# Altium schematic sheet Power_driver_DAC_Connectors.SchDoc
size 420 x 297 mm; Scale: 1:1; DocumentType: Схема электрическая принципиальная; FirstReferrence: АБВГ.123456.001
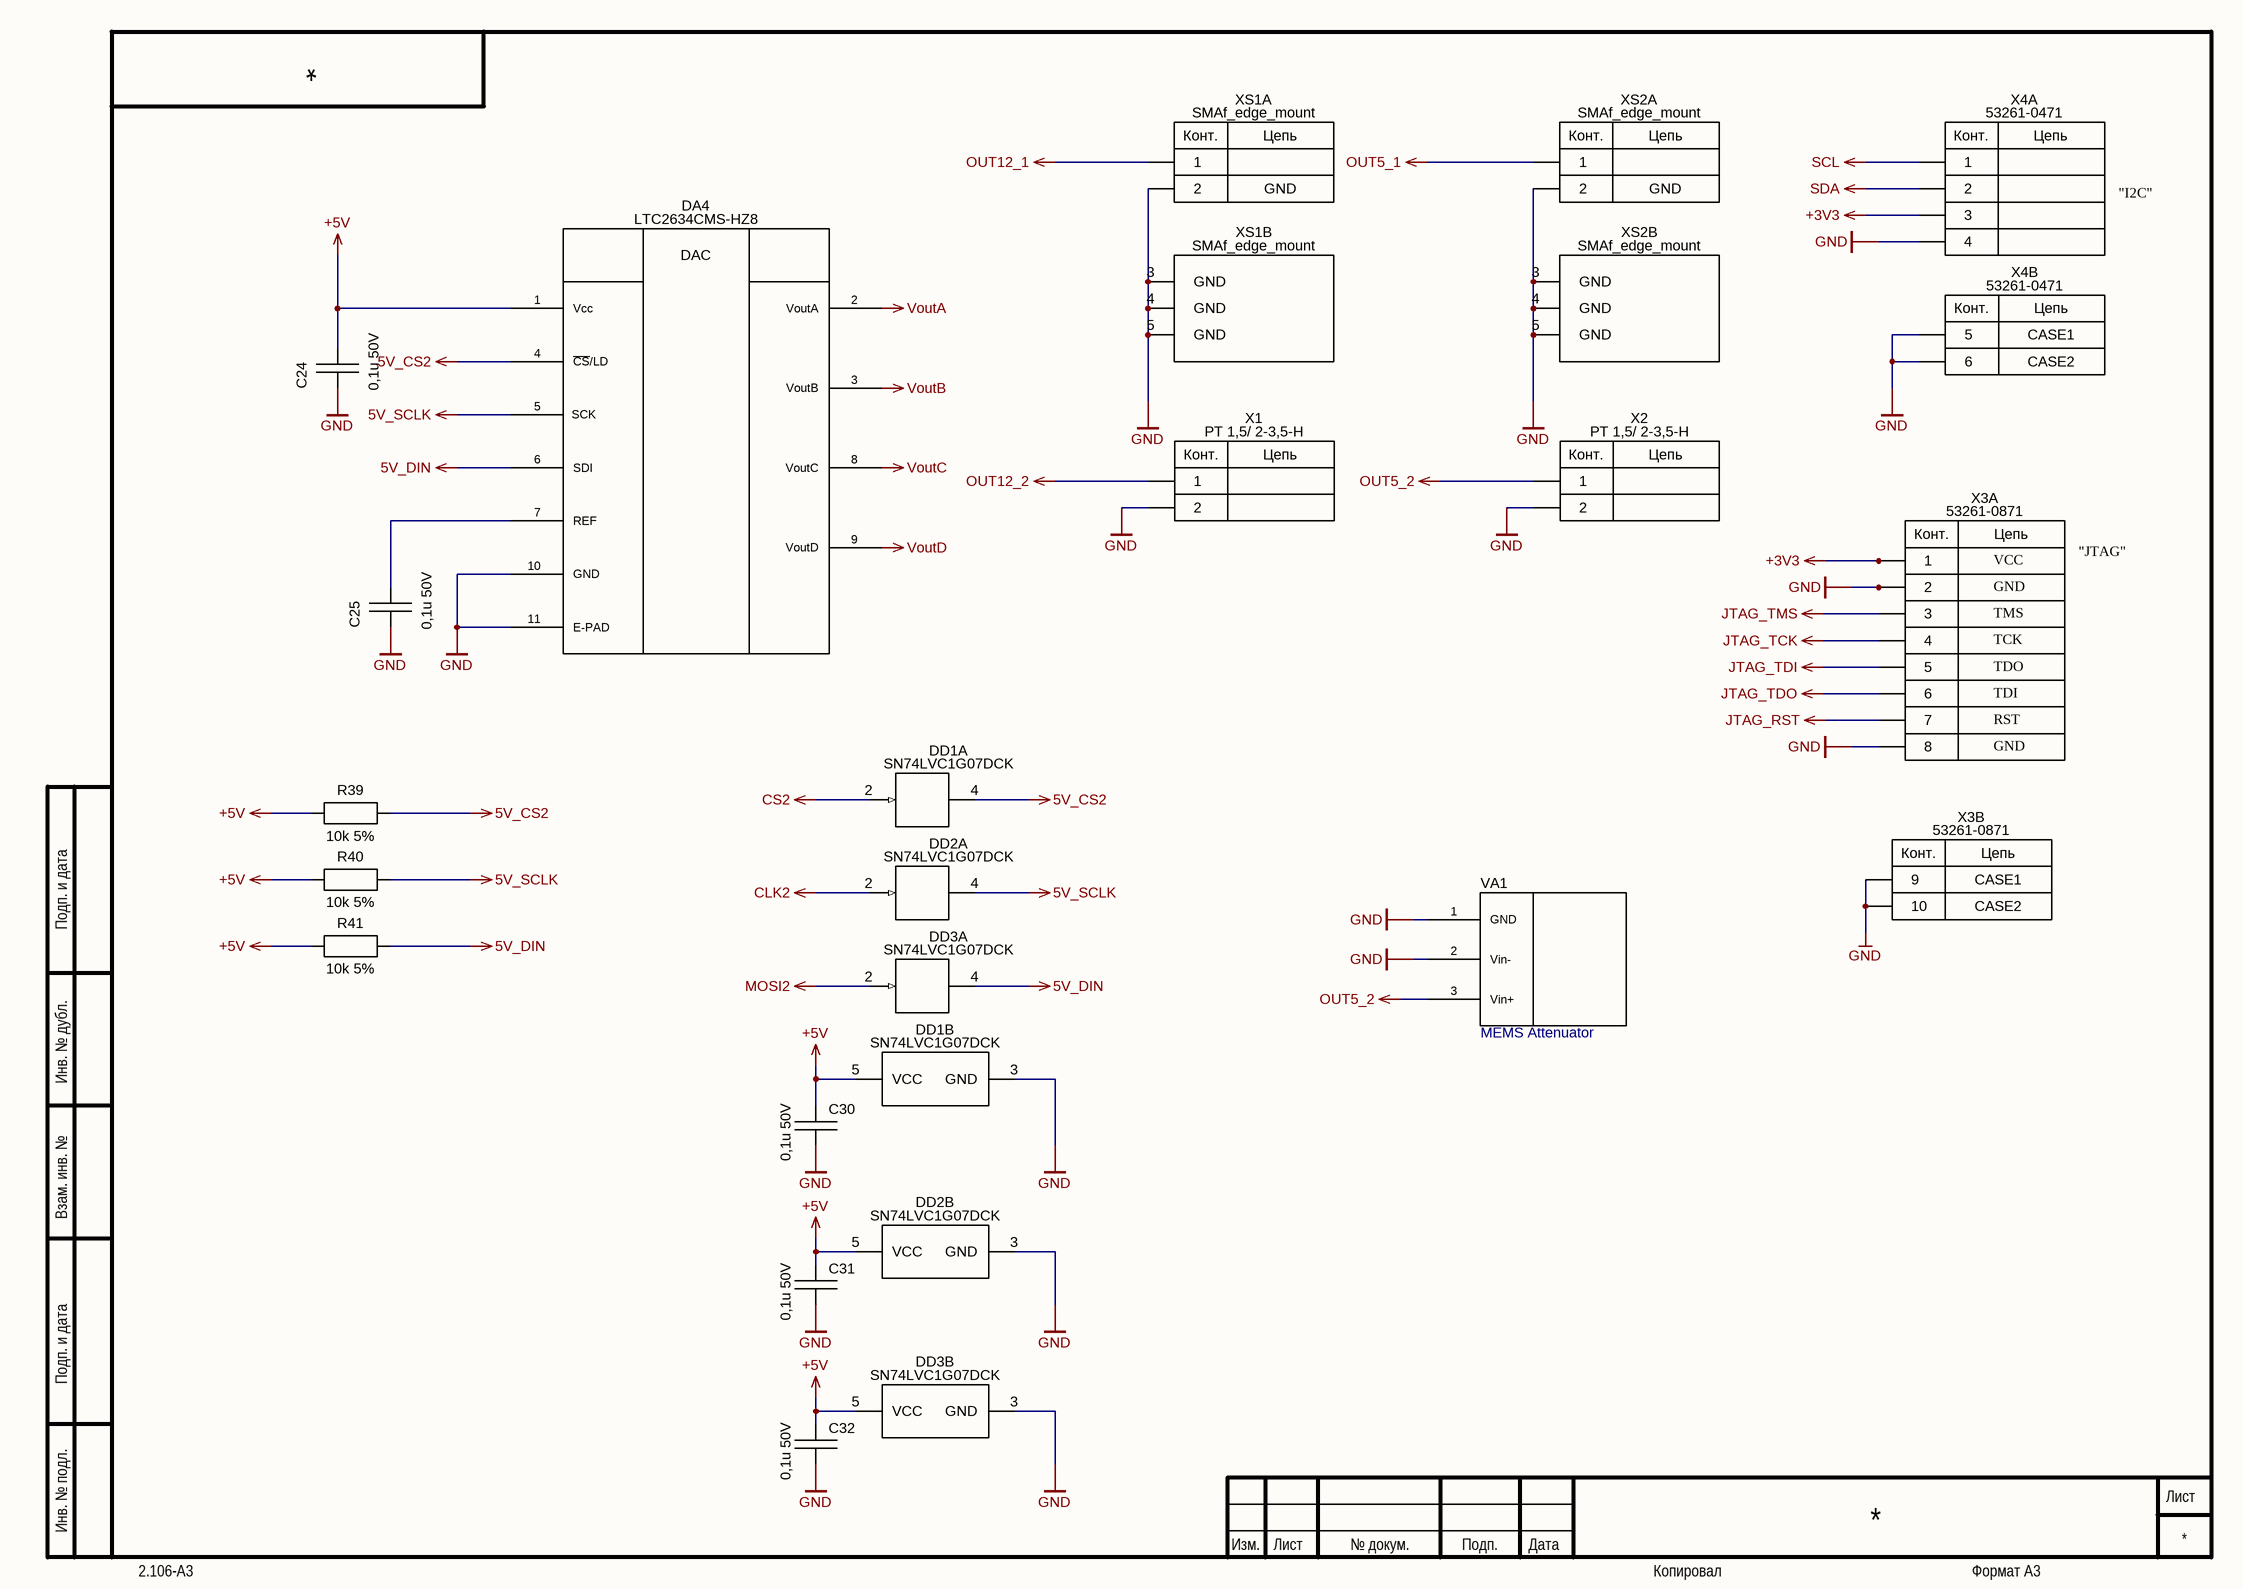
[diagram p0: Power_driver_DAC_Connectors.SchDoc]

## Parts
C24  0,1u 50V  [C0603_CAPC1608X09N]
C25  0,1u 50V  [C0603_CAPC1608X09N]
C30  0,1u 50V  [C0603_CAPC1608X09N]
C31  0,1u 50V  [C0603_CAPC1608X09N]
C32  0,1u 50V  [C0603_CAPC1608X09N]
DA4  LTC2634CMS-HZ8  [MSOP50P500X110_HS-11N]
DD1  SN74LVC1G07DCK  [SC70_SOT65P210X110-5N]  (parts A,B of 2)
DD2  SN74LVC1G07DCK  [SC70_SOT65P210X110-5N]  (parts A,B of 2)
DD3  SN74LVC1G07DCK  [SC70_SOT65P210X110-5N]  (parts A,B of 2)
R39  10k 5%  [R0603_RESC1608X06N]
R40  10k 5%  [R0603_RESC1608X06N]
R41  10k 5%  [R0603_RESC1608X06N]
VA1  MEMS Attenuator  [Attenuator]
X1  PT 1,5/ 2-3,5-H  [PT 1,5/ 2-3,5-H]
X2  PT 1,5/ 2-3,5-H  [PT 1,5/ 2-3,5-H]
X3  53261-0871  [53261-0871]  (parts A,B of 2)
X4  53261-0471  [53261-0471]  (parts A,B of 2)
XS1  SMAf_edge_mount  [142-0701-851]  (parts A,B of 2)
XS2  SMAf_edge_mount  [142-0701-851]  (parts A,B of 2)

## Nets
5V_CS2: DA4.4(~{CS}/LD) DD1.4(Y) R39.2
5V_DIN: DA4.6(SDI) DD3.4(Y) R41.2
5V_SCLK: DA4.5(SCK) DD2.4(Y) R40.2
+3V3: X3.1 X4.3
+5V: C24.2 C30.1 C31.1 C32.1 DA4.1(Vcc) DD1.5(VCC) DD2.5(VCC) DD3.5(VCC) R39.1 R40.1 R41.1
CLK2: DD2.2(A)
CS2: DD1.2(A)
GND: C24.1 C25.1 C30.2 C31.2 C32.2 DA4.10(GND) DA4.11(E-PAD) DD1.3(GND) DD2.3(GND) DD3.3(GND) VA1.1(GND) VA1.2(Vin-) X1.2 X2.2 X3.2 X3.8 X3.9 X3.10 X4.4 X4.5 X4.6 XS1.2 XS1.3(GND) XS1.4(GND) XS1.5(GND) XS2.2 XS2.3(GND) XS2.4(GND) XS2.5(GND)
JTAG_RST: X3.7
JTAG_TCK: X3.4
JTAG_TDI: X3.5
JTAG_TDO: X3.6
JTAG_TMS: X3.3
MOSI2: DD3.2(A)
OUT5_1: XS2.1
OUT5_2: VA1.3(Vin+) X2.1
OUT12_1: XS1.1
OUT12_2: X1.1
SCL: X4.1
SDA: X4.2
VoutA: DA4.2(VoutA)
VoutB: DA4.3(VoutB)
VoutC: DA4.8(VoutC)
VoutD: DA4.9(VoutD)
NetC25_2: C25.2 DA4.7(REF)

## Notes on the sheet
- "I2C"
- VCC
- GND
- "JTAG"
- TMS
- TCK
- TDO
- TDI
- RST
- Подп. и дата
- Инв. № дубл.
- Взам. инв. №
- Инв. № подл.
- Изм.
- Лист
- № докум.
- Подп.
- Дата
- 2.106-A3
- Копировал
- Формат А3
- (in symbol 142-0701-851, part A) Конт.; Цепь
- (in symbol 53261-0471, part A) Конт.; Цепь
- (in symbol 53261-0471, part B) Конт.; Цепь; CASE1; CASE2
- (in symbol 53261-0871, part A) Конт.; Цепь
- (in symbol 53261-0871, part B) Конт.; Цепь; CASE1; CASE2
- (in symbol LTC2634CMS-HZ8) DAC
- (in symbol PT 1,5/ 2-3,5-H) Конт.; Цепь

## Library data of the parts
C24 C25 C30-C32 = CC0603KRX7R9BB104: Конденсатор керамический (MLCC) общего назначения 0603; Manufacturer: YAGEO; ValueBOM: 0,1мкФ ±10% 50В X7R 0603; ModelSTEP: Z:\LIB\ALTIUM\MODEL\STEP\Capacitor\C0603_CAPC1608X09.Step; Designer: Dudarev; EOL: NO; PartNumber: CC0603KRX7R9BB104; ValueSCH: 0,1u 50V; Mount: SMT; HelpURL: Z:\LIB\ALTIUM\INFO\Capacitor\UPY-GPHC_X7R_6.3V-to-50V_13.pdf; Modify: 28.06.2016
DA4 = LTC2634CMS-HZ8: SPI  Vout quad DAC with internal reference. MSOP 10
DD1-DD3 = SN74LVC1G07DCK: Single buffer\driver with open-drain outputs for 1.65 - 5.5V VCC operation SC70; Manufacturer: TI; ModelSTEP: Z:\LIB\ALTIUM\MODEL\STEP\IC_SO\SC70_SOT65P210X110-5.Step; Designer: Dudarev; EOL: NO; PartNumber: SN74LVC1G07DCK; ValueBOM: SN74LVC1G07DCK; ValueSCH: SN74LVC1G07DCK; Mount: SMT; HelpURL: Z:\LIB\ALTIUM\INFO\IC_Logic\sn74lvc1g07.pdf; Modify: 28.06.2016
R39-R41 = RC0603JR-0710KL: Резистор толстопленочный общего назначения 0603; Manufacturer: YAGEO; ValueBOM: 10кОм 5% 75В 150ppm 0603; ModelSTEP: Z:\LIB\ALTIUM\MODEL\STEP\Resistor\R0603_RESC1005X04.step; Designer: Dudarev; EOL: NO; PartNumber: RC0603JR-0710KL; ValueSCH: 10k 5%; Mount: SMT; HelpURL: Z:\LIB\ALTIUM\INFO\Resistor\YAGEO\Lead free chip resistors RC_P.pdf; Modify: 28.06.2016
X1 X2 = PT 1,5/ 2-3,5-H: PT 1,5/ 2-3,5-H Terminal Block Connector. Strait
X3 = 53261-0871: PicoBlade Header, 1,25mm Pitch, 1 Row, 8 Circuits, Right Angle, SMT; Manufacturer: Molex; ModelSTEP: Z:\LIB\ALTIUM\MODEL\STEP\Connector_PIN\532610871.step; Designer: Martynov; EOL: NO; PartNumber: 53261-0871; ValueBOM: 53261-0871; ValueSCH: 53261-0871; Mount: SMT; HelpURL: Z:\LIB\ALTIUM\INFO\Connector_PIN\53261-0xxx.pdf; Modify: 10.04.2017
X4 = 53261-0471: PicoBlade Header, 1,25mm Pitch, 1 Row, 4 Circuits, Right Angle, SMT; Manufacturer: Molex; ModelSTEP: Z:\LIB\ALTIUM\MODEL\STEP\Connector_PIN\532610471.step; Designer: Martynov; EOL: NO; PartNumber: 53261-0471; ValueBOM: 53261-0471; ValueSCH: 53261-0471; Mount: SMT; HelpURL: Z:\LIB\ALTIUM\INFO\Connector_PIN\53261-0xxx.pdf; Modify: 10.04.2017
XS1 XS2 = 142-0701-851: RF COAXIAL CONNECTOR 50 Ohms, 18GHz, SMA FEMALE,  PCB 1,5mm edge mounted, SMT; Manufacturer: Johnson; ModelSTEP: Z:\LIB\ALTIUM\MODEL\STEP\Connector_Misc\dr-3d-CSS-JOHN-142-0701-851.stp; Designer: Pashinskiy; EOL: NO; PartNumber: 142-0701-851; ValueBOM: 142-0701-851; ValueSCH: SMAf_edge_mount; Mount: SMT; HelpURL: Z:\LIB\ALTIUM\INFO\Connector_Misc\dr-1420701851.pdf; Modify: 09.02.2017